# EAGLE design led_analog_clock_v2 (EAGLE 5.09)
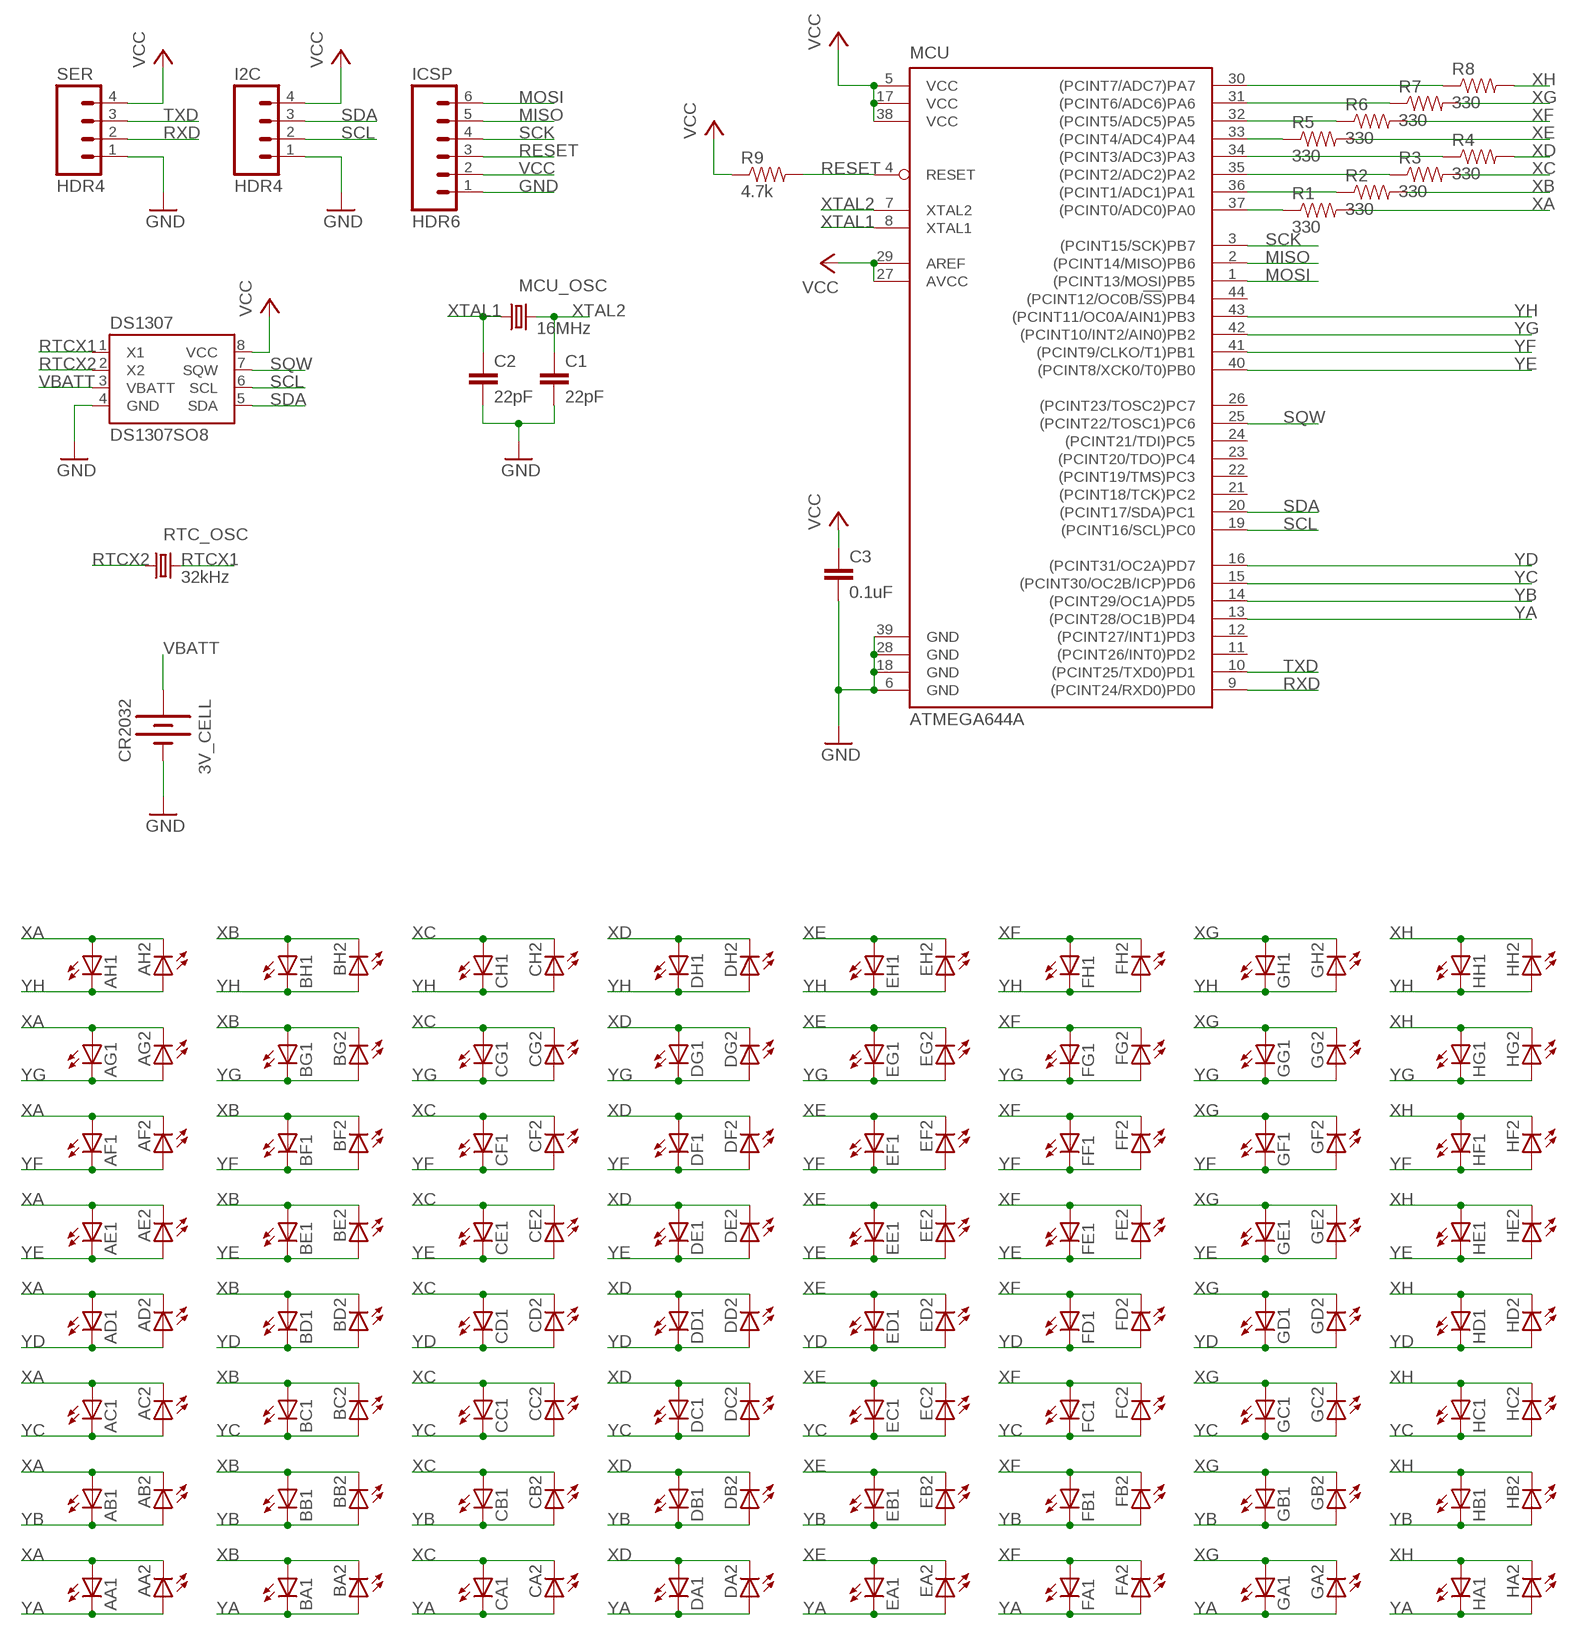
[diagram p0: schematic, sheet 1]

## Parts
3V_CELL  CR2032  BATTERY20PTH  [BATTCOM_20MM_PTH]
AA1  LED0603  [LED-0603]
AA2  LED0603  [LED-0603]
AB1  LED0603  [LED-0603]
AB2  LED0603  [LED-0603]
AC1  LED0603  [LED-0603]
AC2  LED0603  [LED-0603]
AD1  LED0603  [LED-0603]
AD2  LED0603  [LED-0603]
AE1  LED0603  [LED-0603]
AE2  LED0603  [LED-0603]
AF1  LED0603  [LED-0603]
AF2  LED0603  [LED-0603]
AG1  LED0603  [LED-0603]
AG2  LED0603  [LED-0603]
AH1  LED0603  [LED-0603]
AH2  LED0603  [LED-0603]
BA1  LED0603  [LED-0603]
BA2  LED0603  [LED-0603]
BB1  LED0603  [LED-0603]
BB2  LED0603  [LED-0603]
BC1  LED0603  [LED-0603]
BC2  LED0603  [LED-0603]
BD1  LED0603  [LED-0603]
BD2  LED0603  [LED-0603]
BE1  LED0603  [LED-0603]
BE2  LED0603  [LED-0603]
BF1  LED0603  [LED-0603]
BF2  LED0603  [LED-0603]
BG1  LED0603  [LED-0603]
BG2  LED0603  [LED-0603]
BH1  LED0603  [LED-0603]
BH2  LED0603  [LED-0603]
C1  22pF  CAP0603-CAP  [0603-CAP]
C2  22pF  CAP0603-CAP  [0603-CAP]
C3  0.1uF  CAP0603-CAP  [0603-CAP]
CA1  LED0603  [LED-0603]
CA2  LED0603  [LED-0603]
CB1  LED0603  [LED-0603]
CB2  LED0603  [LED-0603]
CC1  LED0603  [LED-0603]
CC2  LED0603  [LED-0603]
CD1  LED0603  [LED-0603]
CD2  LED0603  [LED-0603]
CE1  LED0603  [LED-0603]
CE2  LED0603  [LED-0603]
CF1  LED0603  [LED-0603]
CF2  LED0603  [LED-0603]
CG1  LED0603  [LED-0603]
CG2  LED0603  [LED-0603]
CH1  LED0603  [LED-0603]
CH2  LED0603  [LED-0603]
DA1  LED0603  [LED-0603]
DA2  LED0603  [LED-0603]
DB1  LED0603  [LED-0603]
DB2  LED0603  [LED-0603]
DC1  LED0603  [LED-0603]
DC2  LED0603  [LED-0603]
DD1  LED0603  [LED-0603]
DD2  LED0603  [LED-0603]
DE1  LED0603  [LED-0603]
DE2  LED0603  [LED-0603]
DF1  LED0603  [LED-0603]
DF2  LED0603  [LED-0603]
DG1  LED0603  [LED-0603]
DG2  LED0603  [LED-0603]
DH1  LED0603  [LED-0603]
DH2  LED0603  [LED-0603]
DS1307  DS1307SO8  [SO08]
EA1  LED0603  [LED-0603]
EA2  LED0603  [LED-0603]
EB1  LED0603  [LED-0603]
EB2  LED0603  [LED-0603]
EC1  LED0603  [LED-0603]
EC2  LED0603  [LED-0603]
ED1  LED0603  [LED-0603]
ED2  LED0603  [LED-0603]
EE1  LED0603  [LED-0603]
EE2  LED0603  [LED-0603]
EF1  LED0603  [LED-0603]
EF2  LED0603  [LED-0603]
EG1  LED0603  [LED-0603]
EG2  LED0603  [LED-0603]
EH1  LED0603  [LED-0603]
EH2  LED0603  [LED-0603]
FA1  LED0603  [LED-0603]
FA2  LED0603  [LED-0603]
FB1  LED0603  [LED-0603]
FB2  LED0603  [LED-0603]
FC1  LED0603  [LED-0603]
FC2  LED0603  [LED-0603]
FD1  LED0603  [LED-0603]
FD2  LED0603  [LED-0603]
FE1  LED0603  [LED-0603]
FE2  LED0603  [LED-0603]
FF1  LED0603  [LED-0603]
FF2  LED0603  [LED-0603]
FG1  LED0603  [LED-0603]
FG2  LED0603  [LED-0603]
FH1  LED0603  [LED-0603]
FH2  LED0603  [LED-0603]
GA1  LED0603  [LED-0603]
GA2  LED0603  [LED-0603]
GB1  LED0603  [LED-0603]
GB2  LED0603  [LED-0603]
GC1  LED0603  [LED-0603]
GC2  LED0603  [LED-0603]
GD1  LED0603  [LED-0603]
GD2  LED0603  [LED-0603]
GE1  LED0603  [LED-0603]
GE2  LED0603  [LED-0603]
GF1  LED0603  [LED-0603]
GF2  LED0603  [LED-0603]
GG1  LED0603  [LED-0603]
GG2  LED0603  [LED-0603]
GH1  LED0603  [LED-0603]
GH2  LED0603  [LED-0603]
HA1  LED0603  [LED-0603]
HA2  LED0603  [LED-0603]
HB1  LED0603  [LED-0603]
HB2  LED0603  [LED-0603]
HC1  LED0603  [LED-0603]
HC2  LED0603  [LED-0603]
HD1  LED0603  [LED-0603]
HD2  LED0603  [LED-0603]
HE1  LED0603  [LED-0603]
HE2  LED0603  [LED-0603]
HF1  LED0603  [LED-0603]
HF2  LED0603  [LED-0603]
HG1  LED0603  [LED-0603]
HG2  LED0603  [LED-0603]
HH1  LED0603  [LED-0603]
HH2  LED0603  [LED-0603]
I2C  HDR4  M04PTH  [1X04]
ICSP  HDR6  M06SIP  [1X06]
MCU  ATMEGA644A  [TQFP44]
MCU_OSC  16MHz  CRYSTAL5X3  [CRYSTAL-SMD-5X3]
R1  330  RESISTOR0603-RES  [0603-RES]
R2  330  RESISTOR0603-RES  [0603-RES]
R3  330  RESISTOR0603-RES  [0603-RES]
R4  330  RESISTOR0603-RES  [0603-RES]
R5  330  RESISTOR0603-RES  [0603-RES]
R6  330  RESISTOR0603-RES  [0603-RES]
R7  330  RESISTOR0603-RES  [0603-RES]
R8  330  RESISTOR0603-RES  [0603-RES]
R9  4.7k  RESISTOR0603-RES  [0603-RES]
RTC_OSC  32kHz  CRYSTAL32-SMD  [CRYSTAL-32KHZ-SMD]
SER  HDR4  M04PTH  [1X04]

## Nets
GND [supply]: 3V_CELL.2(-) C1.2 C2.2 C3.2 DS1307.4(GND) I2C.1 ICSP.1 MCU.6(GND) MCU.18(GND) MCU.28(GND) MCU.39(GND) SER.1
MISO: ICSP.5 MCU.2((PCINT14/MISO)PB6)
MOSI: ICSP.6 MCU.1((PCINT13/MOSI)PB5)
N$1: MCU.30((PCINT7/ADC7)PA7) R8.1
N$2: MCU.31((PCINT6/ADC6)PA6) R7.1
N$3: MCU.32((PCINT5/ADC5)PA5) R6.1
N$4: MCU.33((PCINT4/ADC4)PA4) R5.1
N$5: MCU.34((PCINT3/ADC3)PA3) R4.1
N$6: MCU.35((PCINT2/ADC2)PA2) R3.1
N$7: MCU.36((PCINT1/ADC1)PA1) R2.1
N$8: MCU.37((PCINT0/ADC0)PA0) R1.1
RESET: ICSP.3 MCU.4(RESET) R9.2
RTCX1: DS1307.1(X1) RTC_OSC.X2
RTCX2: DS1307.2(X2) RTC_OSC.X1
RXD: MCU.9((PCINT24/RXD0)PD0) SER.2
SCK: ICSP.4 MCU.3((PCINT15/SCK)PB7)
SCL: DS1307.6(SCL) I2C.2 MCU.19((PCINT16/SCL)PC0)
SDA: DS1307.5(SDA) I2C.3 MCU.20((PCINT17/SDA)PC1)
SQW: DS1307.7(SQW) MCU.25((PCINT22/TOSC1)PC6)
TXD: MCU.10((PCINT25/TXD0)PD1) SER.3
VBATT: 3V_CELL.1(+) DS1307.3(VBATT)
VCC [supply]: C3.1 DS1307.8(VCC) I2C.4 ICSP.2 MCU.5(VCC) MCU.17(VCC) MCU.27(AVCC) MCU.29(AREF) MCU.38(VCC) R9.1 SER.4
XA: AA1.A AA2.C AB1.A AB2.C AC1.A AC2.C AD1.A AD2.C AE1.A AE2.C AF1.A AF2.C AG1.A AG2.C AH1.A AH2.C R1.2
XB: BA1.A BA2.C BB1.A BB2.C BC1.A BC2.C BD1.A BD2.C BE1.A BE2.C BF1.A BF2.C BG1.A BG2.C BH1.A BH2.C R2.2
XC: CA1.A CA2.C CB1.A CB2.C CC1.A CC2.C CD1.A CD2.C CE1.A CE2.C CF1.A CF2.C CG1.A CG2.C CH1.A CH2.C R3.2
XD: DA1.A DA2.C DB1.A DB2.C DC1.A DC2.C DD1.A DD2.C DE1.A DE2.C DF1.A DF2.C DG1.A DG2.C DH1.A DH2.C R4.2
XE: EA1.A EA2.C EB1.A EB2.C EC1.A EC2.C ED1.A ED2.C EE1.A EE2.C EF1.A EF2.C EG1.A EG2.C EH1.A EH2.C R5.2
XF: FA1.A FA2.C FB1.A FB2.C FC1.A FC2.C FD1.A FD2.C FE1.A FE2.C FF1.A FF2.C FG1.A FG2.C FH1.A FH2.C R6.2
XG: GA1.A GA2.C GB1.A GB2.C GC1.A GC2.C GD1.A GD2.C GE1.A GE2.C GF1.A GF2.C GG1.A GG2.C GH1.A GH2.C R7.2
XH: HA1.A HA2.C HB1.A HB2.C HC1.A HC2.C HD1.A HD2.C HE1.A HE2.C HF1.A HF2.C HG1.A HG2.C HH1.A HH2.C R8.2
XTAL1: C2.1 MCU.8(XTAL1) MCU_OSC.1
XTAL2: C1.1 MCU.7(XTAL2) MCU_OSC.3
YA: AA1.C AA2.A BA1.C BA2.A CA1.C CA2.A DA1.C DA2.A EA1.C EA2.A FA1.C FA2.A GA1.C GA2.A HA1.C HA2.A MCU.13((PCINT28/OC1B)PD4)
YB: AB1.C AB2.A BB1.C BB2.A CB1.C CB2.A DB1.C DB2.A EB1.C EB2.A FB1.C FB2.A GB1.C GB2.A HB1.C HB2.A MCU.14((PCINT29/OC1A)PD5)
YC: AC1.C AC2.A BC1.C BC2.A CC1.C CC2.A DC1.C DC2.A EC1.C EC2.A FC1.C FC2.A GC1.C GC2.A HC1.C HC2.A MCU.15((PCINT30/OC2B/ICP)PD6)
YD: AD1.C AD2.A BD1.C BD2.A CD1.C CD2.A DD1.C DD2.A ED1.C ED2.A FD1.C FD2.A GD1.C GD2.A HD1.C HD2.A MCU.16((PCINT31/OC2A)PD7)
YE: AE1.C AE2.A BE1.C BE2.A CE1.C CE2.A DE1.C DE2.A EE1.C EE2.A FE1.C FE2.A GE1.C GE2.A HE1.C HE2.A MCU.40((PCINT8/XCK0/T0)PB0)
YF: AF1.C AF2.A BF1.C BF2.A CF1.C CF2.A DF1.C DF2.A EF1.C EF2.A FF1.C FF2.A GF1.C GF2.A HF1.C HF2.A MCU.41((PCINT9/CLKO/T1)PB1)
YG: AG1.C AG2.A BG1.C BG2.A CG1.C CG2.A DG1.C DG2.A EG1.C EG2.A FG1.C FG2.A GG1.C GG2.A HG1.C HG2.A MCU.42((PCINT10/INT2/AIN0)PB2)
YH: AH1.C AH2.A BH1.C BH2.A CH1.C CH2.A DH1.C DH2.A EH1.C EH2.A FH1.C FH2.A GH1.C GH2.A HH1.C HH2.A MCU.43((PCINT11/OC0A/AIN1)PB3)
Unconnected: MCU.11((PCINT26/INT0)PD2) MCU.12((PCINT27/INT1)PD3) MCU.21((PCINT18/TCK)PC2) MCU.22((PCINT19/TMS)PC3) MCU.23((PCINT20/TDO)PC4) MCU.24((PCINT21/TDI)PC5) MCU.26((PCINT23/TOSC2)PC7) MCU.44((PCINT12/OC0B/!SS!)PB4)

## Library data of the parts
3V_CELL = SparkFun:BATTERY: Battery Holders Various common sizes : AA, AAA, 20mm coin cell and 12mm coin cell.
AA1 AA2 AB1 AB2 AC1 AC2 AD1 AD2 AE1 AE2 AF1 AF2 AG1 AG2 AH1 AH2 BA1 BA2 BB1 BB2 BC1 BC2 BD1 BD2 BE1 BE2 BF1 BF2 BG1 BG2 BH1 BH2 CA1 CA2 CB1 CB2 CC1 CC2 CD1 CD2 CE1 CE2 CF1 CF2 CG1 CG2 CH1 CH2 DA1 DA2 DB1 DB2 DC1 DC2 DD1 DD2 DE1 DE2 DF1 DF2 DG1 DG2 DH1 DH2 EA1 EA2 EB1 EB2 EC1 EC2 ED1 ED2 EE1 EE2 EF1 EF2 EG1 EG2 EH1 EH2 FA1 FA2 FB1 FB2 FC1 FC2 FD1 FD2 FE1 FE2 FF1 FF2 FG1 FG2 FH1 FH2 GA1 GA2 GB1 GB2 GC1 GC2 GD1 GD2 GE1 GE2 GF1 GF2 GG1 GG2 GH1 GH2 HA1 HA2 HB1 HB2 HC1 HC2 HD1 HD2 HE1 HE2 HF1 HF2 HG1 HG2 HH1 HH2 = SparkFun:LED: LEDs Standard schematic elements and footprints for 5mm, 3mm, 1206, and 0603 sized LEDs. 5mm - Spark Fun Electronics SKU : COM-00529 (and others)
C1-C3 = SparkFun:CAP: Capacitor Standard 0603 ceramic capacitor, and 0.1" leaded capacitor.
DS1307 = SparkFun:DS1307
I2C SER = SparkFun:M04: Header 4 Standard 4-pin 0.1" header. Use with straight break away headers (SKU : PRT-00116), right angle break away headers (PRT-00553), swiss pins (PRT-00743), machine pins (PRT-00117), and female headers (PRT-00115). Molex polarized connector foot print use with SKU : PRT-08231 with associated crimp pins and housings.
ICSP = SparkFun:M06: Header 6 Standard 6-pin 0.1" header. Use with straight break away headers (SKU : PRT-00116), right angle break away headers (PRT-00553), swiss pins (PRT-00743), machine pins (PRT-00117), and female headers (PRT-00115). Molex polarized connector foot print use with SKU : PRT-08094 with associated crimp pins and housings. NOTES ON THE VARIANTS LOCK and LOCK_LONGPADS... This footprint was designed to help hold the alignment of a through-hole component (i.e. 6-pin header) while soldering it into place. You may notice that each hole has been shifted either up or down by 0.005 of an inch from it's more standard position (which is a perfectly straight line). This slight alteration caused the pins (the squares in the middle) to touch the edges of the holes. Because they are alternating, it causes a "brace" to hold the component in place. 0.005 has proven to be the perfect amount of "off-center" position when using our standard breakaway headers. Although looks a little odd when you look at the bare footprint, once you have a header in there, the alteration is very hard to notice. Also, if you push a header all the way into place, it is covered up entirely on the bottom side. This idea of altering the position of holes to aid alignment will be further integrated into the Sparkfun Library for other footprints. It can help hold any component with 3 or more connection pins.
MCU = atmel:ATMEGA644: 8-bit Microcontroller with 64K Bytes In-System Programmable Flash Source: http://www.atmel.com/dyn/resources/prod_documents/doc2593.pdf
MCU_OSC RTC_OSC = SparkFun:CRYSTAL: Crystals Various standard crystals. Proven footprints. Spark Fun Electronics SKU : COM-00534
R1-R9 = SparkFun:RESISTOR: Resistor Basic schematic elements and footprints for 0603, 1206, and PTH 1/10th watt (small) resistors.

## Net classes
0 signal: width 0.203 mm
1 supply: width 0.305 mm

## Board
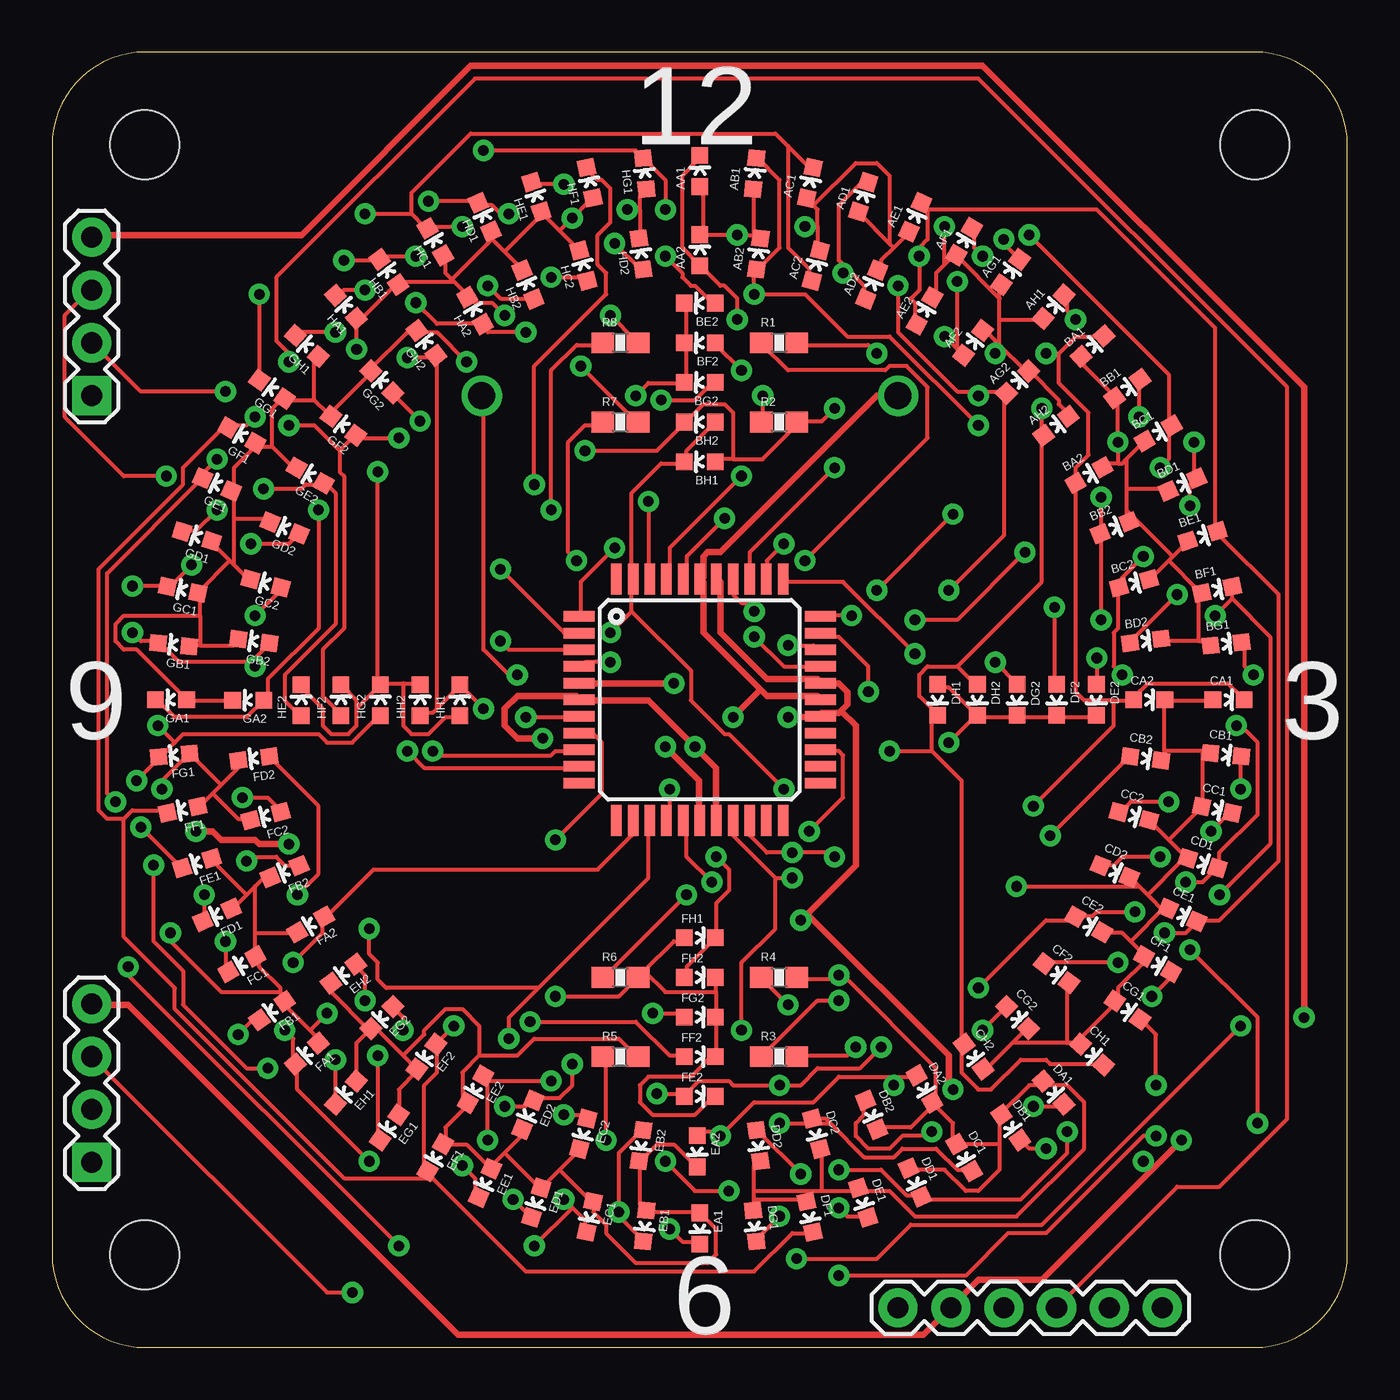
[diagram p1: board, top side]
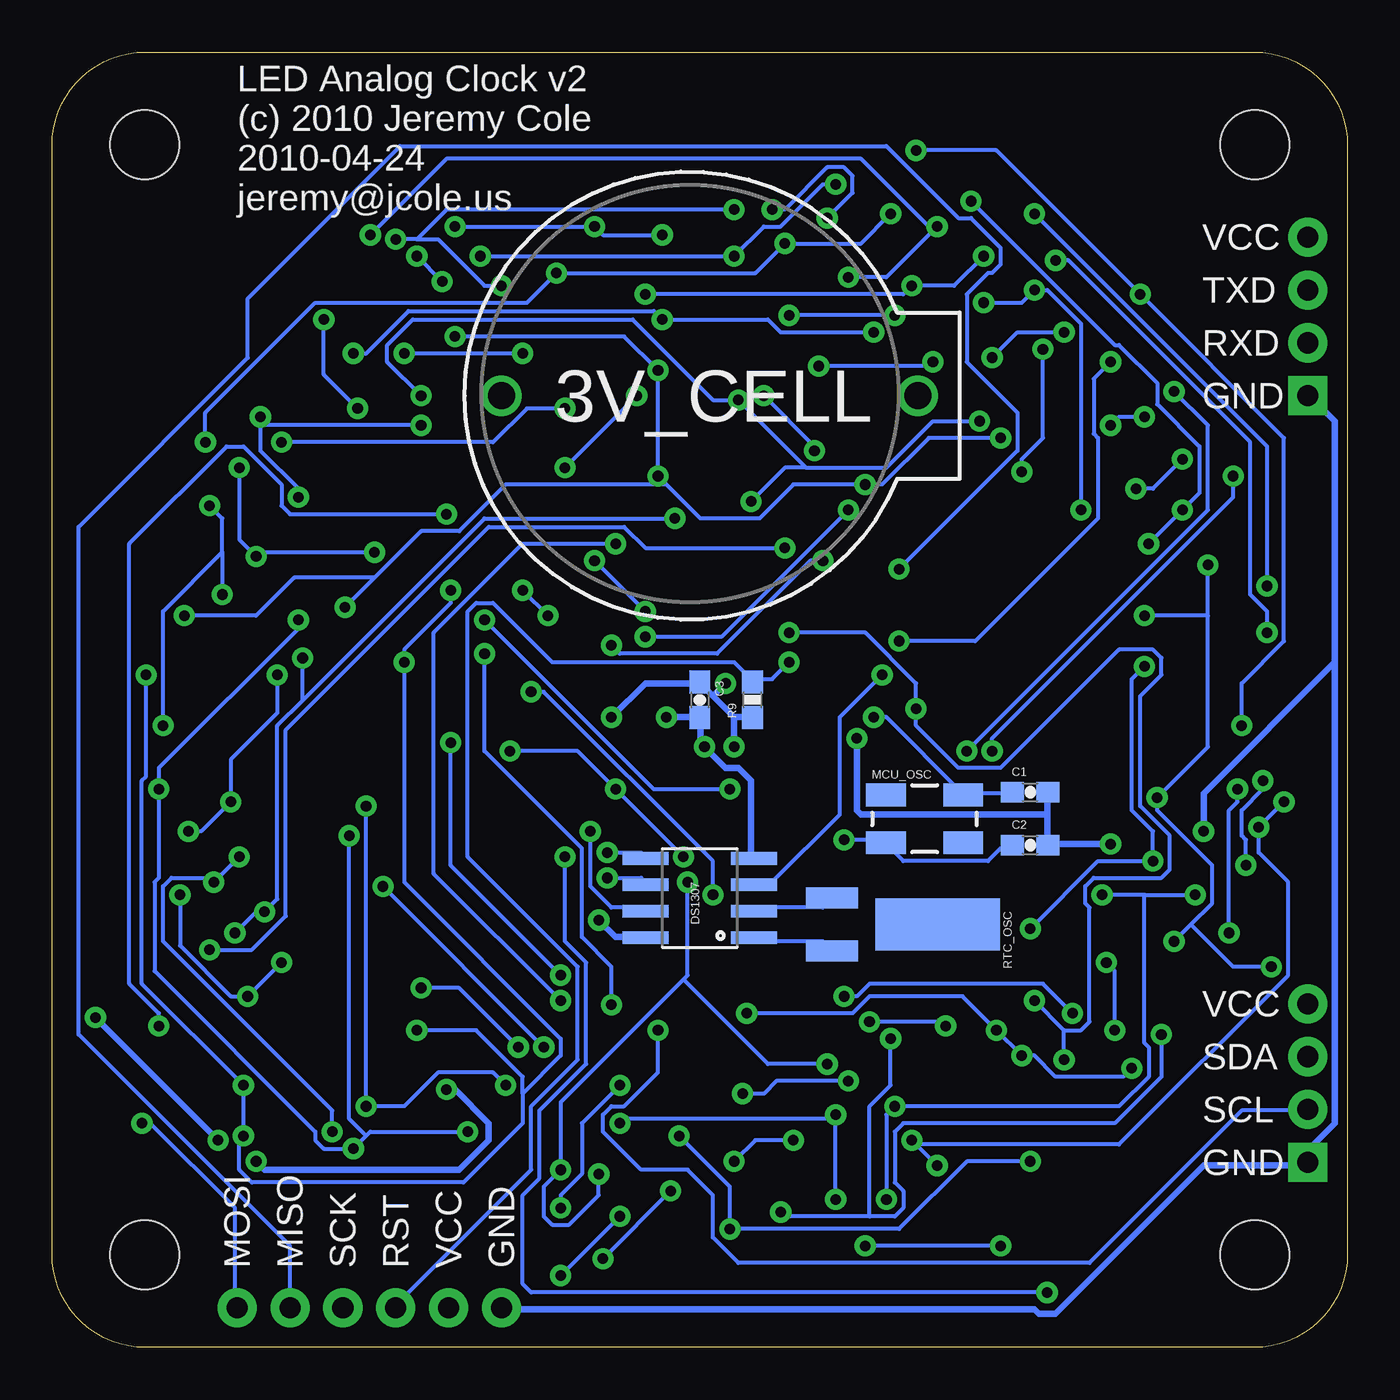
[diagram p2: board, bottom side, seen from below]

Size 62.23 x 62.23 mm. Coordinates in mm from the lower left corner, seen from the top.
Outline: 0,4.49 arc90 4.49,0 57.74,0 arc90 62.23,4.49 62.23,57.74 arc90 57.74,62.23 4.49,62.23 arc90 0,57.74 0,4.49
Copper layers (1*16): Top 0.035mm / dielectric 1.5mm / Bottom 0.035mm
Design rules "SparkFun": minimum track width 8mil, minimum drill 20mil, track to track 8mil, track to pad 8mil, pad to pad 8mil, via to via 8mil, smd to smd 8mil, copper to edge 10mil, drill to drill 8mil, minimum pad ring 12mil, minimum via ring 10mil, stop-mask expansion 4mil, vias tented up to drill 25mil, thermal gap 10mil
tRestrict: area 17.1,23.5 to 23.5,27.3; area 15.9,17.8 to 23.5,22.9; area 0,0 to 7.6,7.6; area 54.6,0 to 62.2,7.6; area 0,54.6 to 7.6,62.2; area 54.6,54.6 to 62.2,62.2
bRestrict: area 15.9,17.8 to 23.5,22.9; area 0,54.6 to 7.6,62.2; area 54.6,54.6 to 62.2,62.2; area 54.6,0 to 62.2,7.6; area 0,0 to 7.6,7.6
vRestrict: area 0,28.6 to 3.8,33.7; area 58.4,28.6 to 62.2,33.7; area 29.2,0 to 33,5.1; area 27.3,57.1 to 34.9,62.2; area 0.6,7.6 to 7.6,17.8; area 0.6,44.5 to 7.6,54.6; area 39.4,0.6 to 54.6,8.3; area 15.9,17.8 to 27.3,22.9; area 17.1,23.5 to 23.5,27.3; area 31.1,54.6 to 54,62.2

### Footprints (pad centres in the part's own frame; a part is rotated, then mirrored left to right if it is on the bottom)
BATTCOM_20MM_PTH = drill 1.3 round: 1 20,0; 2 0,0
LED-0603 = smd 0.8 x 0.8: A 0,-0.75; C 0,0.75
0603-CAP = smd 1.1 x 1: 1 -0.85,0; 2 0.85,0
SO08 = smd 0.61 x 2.21: 1 -1.905,-2.616; 2 -0.635,-2.616; 3 0.635,-2.616; 4 1.905,-2.616; 5 1.905,2.616; 6 0.635,2.616; 7 -0.635,2.616; 8 -1.905,2.616
1X04 = drill 1.016 pad 1.88 square: 1 0,0 | drill 1.016 pad 1.88 round: 2 2.54,0; 3 5.08,0; 4 7.62,0
1X06 = drill 1.016 pad 1.88 round: 1 0,0; 2 2.54,0; 3 5.08,0; 4 7.62,0; 5 10.16,0; 6 12.7,0
TQFP44 = smd 1.5 x 0.5: 1 -5.8,4; 2 -5.8,3.2; 3 -5.8,2.4; 4 -5.8,1.6; 5 -5.8,0.8; 6 -5.8,0; 7 -5.8,-0.8; 8 -5.8,-1.6; 9 -5.8,-2.4; 10 -5.8,-3.2; 11 -5.8,-4; 23 5.8,-4; 24 5.8,-3.2; 25 5.8,-2.4; 26 5.8,-1.6; 27 5.8,-0.8; 28 5.8,0; 29 5.8,0.8; 30 5.8,1.6; 31 5.8,2.4; 32 5.8,3.2; 33 5.8,4 | smd 0.5 x 1.5: 12 -4,-5.8; 13 -3.2,-5.8; 14 -2.4,-5.8; 15 -1.6,-5.8; 16 -0.8,-5.8; 17 0,-5.8; 18 0.8,-5.8; 19 1.6,-5.8; 20 2.4,-5.8; 21 3.2,-5.8; 22 4,-5.8; 34 4,5.8; 35 3.2,5.8; 36 2.4,5.8; 37 1.6,5.8; 38 0.8,5.8; 39 0,5.8; 40 -0.8,5.8; 41 -1.6,5.8; 42 -2.4,5.8; 43 -3.2,5.8; 44 -4,5.8
CRYSTAL-SMD-5X3 = smd 1.9 x 1.1: 1 -1.85,-1.15; 2 1.85,-1.15; 3 1.85,1.15; 4 -1.85,1.15
0603-RES = smd 1.1 x 1: 1 -0.85,0; 2 0.85,0
CRYSTAL-32KHZ-SMD = smd 2.5 x 6: SHEILD 0,5.08 | smd 1 x 2.5: X1 -1.27,0; X2 1.27,0
STAND-OFF = hole 3.302: 0,0

### Placement (x,y rotation side)
3V_CELL  40.64,45.72 0 bottom
AA1  31.11,56.52 0 top
AA2  31.11,52.7 0 top
AB1  33.76,56.39 354 top
AB2  33.93,52.53 352.5 top
AC1  36.41,55.95 348 top
AC2  36.7,51.97 345 top
AD1  38.97,55.27 342 top
AD2  39.38,51.05 337.5 top
AE1  41.47,54.3 336 top
AE2  41.92,49.8 330 top
AF1  43.81,53.12 330 top
AF2  44.24,48.26 322.5 top
AG1  46.04,51.66 324 top
AG2  46.38,46.37 315 top
AH1  48.12,49.99 318 top
AH2  48.23,44.27 307.5 top
BA1  49.99,48.1 312 top
BA2  49.82,41.9 300 top
BB1  51.66,46.06 306 top
BB2  51.04,39.38 292.5 top
BC1  53.14,43.91 300 top
BC2  51.98,36.71 285 top
BD1  54.3,41.45 294 top
BD2  52.53,33.94 277.5 top
BE1  55.27,38.98 288 top
BE2  31.11,50.16 90 top
BF1  55.96,36.4 282 top
BF2  31.11,48.26 90 top
BG1  56.4,33.8 276 top
BG2  31.11,46.35 90 top
BH1  31.11,42.55 90 top
BH2  31.11,44.45 90 top
C1  15.24,26.67 0 bottom
C2  15.24,24.13 0 bottom
C3  31.11,31.11 270 bottom
CA1  56.52,31.11 270 top
CA2  52.7,31.11 270 top
CB1  56.39,28.47 264 top
CB2  52.53,28.3 262.5 top
CC1  55.96,25.83 258 top
CC2  51.97,25.53 255 top
CD1  55.27,23.27 252 top
CD2  51.05,22.86 247.5 top
CE1  54.31,20.78 246 top
CE2  49.81,20.32 240 top
CF1  53.11,18.41 240 top
CF2  48.26,17.98 232.5 top
CG1  51.66,16.21 234 top
CG2  46.38,15.85 225 top
CH1  49.96,14.07 228 top
CH2  44.27,13.97 217.5 top
DA1  48.11,12.24 222 top
DA2  41.91,12.42 210 top
DB1  46.05,10.57 216 top
DB2  39.37,11.18 202.5 top
DC1  43.81,9.12 210 top
DC2  36.7,10.26 195 top
DD1  41.45,7.92 204 top
DD2  33.93,9.7 187.5 top
DE1  38.96,6.96 198 top
DE2  50.16,31.11 180 top
DF1  36.4,6.27 192 top
DF2  48.26,31.11 180 top
DG1  33.76,5.84 186 top
DG2  46.35,31.11 180 top
DH1  42.55,31.11 180 top
DH2  44.45,31.11 180 top
DS1307  31.11,21.59 90 bottom
EA1  31.11,5.71 180 top
EA2  30.99,9.42 180 top
EB1  28.47,5.84 174 top
EB2  28.3,9.7 172.5 top
EC1  25.83,6.27 168 top
EC2  25.53,10.26 165 top
ED1  23.27,6.96 162 top
ED2  22.86,11.18 157.5 top
EE1  20.8,7.9 156 top
EE2  20.35,12.4 150 top
EF1  18.41,9.12 150 top
EF2  17.98,13.97 142.5 top
EG1  16.21,10.57 144 top
EG2  15.85,15.85 135 top
EH1  14.12,12.24 138 top
EH2  14,17.96 127.5 top
FA1  12.24,14.12 132 top
FA2  12.42,20.32 120 top
FB1  10.57,16.18 126 top
FB2  11.18,22.86 112.5 top
FC1  9.12,18.41 120 top
FC2  10.26,25.53 105 top
FD1  7.92,20.78 114 top
FD2  9.7,28.3 97.5 top
FE1  6.96,23.27 108 top
FE2  31.11,12.06 270 top
FF1  6.27,25.83 102 top
FF2  31.11,13.97 270 top
FG1  5.87,28.45 96 top
FG2  31.11,15.88 270 top
FH1  31.11,19.68 270 top
FH2  31.11,17.78 270 top
GA1  5.71,31.11 90 top
GA2  9.42,31.09 90 top
GB1  5.84,33.76 84 top
GB2  9.7,33.93 82.5 top
GC1  6.27,36.4 78 top
GC2  10.26,36.7 75 top
GD1  6.96,38.96 72 top
GD2  11.18,39.37 67.5 top
GE1  7.92,41.45 66 top
GE2  12.4,41.88 60 top
GF1  9.12,43.81 60 top
GF2  14,44.27 52.5 top
GG1  10.57,46.02 54 top
GG2  15.85,46.38 45 top
GH1  12.24,48.11 48 top
GH2  17.98,48.26 37.5 top
HA1  14.12,49.99 42 top
HA2  20.32,49.81 30 top
HB1  16.18,51.66 36 top
HB2  22.86,51.05 22.5 top
HC1  18.41,53.11 30 top
HC2  25.53,51.97 15 top
HD1  20.78,54.31 24 top
HD2  28.3,52.53 7.5 top
HE1  23.27,55.27 18 top
HE2  11.96,31.09 0 top
HF1  25.83,55.96 12 top
HF2  13.87,31.09 0 top
HG1  28.47,56.39 6 top
HG2  15.77,31.09 0 top
HH1  19.58,31.09 0 top
HH2  17.68,31.09 0 top
I2C  1.91,8.89 90 top
ICSP  40.64,1.91 0 top
MCU  31.11,31.11 0 top
MCU_OSC  20.32,25.4 0 bottom
R1  34.92,48.26 0 top
R2  34.92,44.45 0 top
R3  34.92,13.97 0 top
R4  34.92,17.78 0 top
R5  27.3,13.97 0 top
R6  27.3,17.78 0 top
R7  27.3,44.45 0 top
R8  27.3,48.26 0 top
R9  28.57,31.11 90 bottom
RTC_OSC  24.77,20.32 270 bottom
SER  1.91,45.72 90 top
U$1  [STAND-OFF]  57.78,57.78 0 top
U$2  [STAND-OFF]  4.45,57.78 0 top
U$3  [STAND-OFF]  4.45,4.45 0 top
U$4  [STAND-OFF]  57.78,4.45 0 top

### Tracks (layer width: path | path; a pad name or v marks a point on that pad's centre or on a via)
GND  (via drill 0.51)
  Top 0.305: MCU.18 31.9,25.4 31.9,27.84 v30.89,28.85 28.65,31.09 25.4,31.09 MCU.6 25.2,31.29 22.35,31.29 21.74,30.68 21.74,29.87 22.35,29.26 v23.57,29.26 | 34.04,31.6 34.34,31.29 36.78,31.29 MCU.28 | 34.04,31.6 31.29,34.34 31.29,36.78 MCU.39 31.29,36.98 31.29,38 31.5,38.2 32.11,38.2 39.62,45.72 3V_CELL.2 | v32.72,30.28 34.04,31.6 | v11.38,24.18 9.96,24.18 9.75,24.38 8.13,24.38 7.72,24.79 v6.91,24.79
  Bottom 0.305: DS1307.4 28.65,23.57 28.65,27.23 29.26,27.84 29.87,27.84 v30.89,28.85 31.09,29.06 31.09,30.07 C3.2 31.29,30.28 v32.72,30.28 | 14.43,25.6 14.43,26.62 C1.2 | 14.43,25.6 14.43,24.18 C2.2 14.22,24.18 v11.38,24.18 | 14.43,25.6 23.37,25.6 23.57,25.81 v23.57,29.26 | 0.61,32.92 0.61,44.5 1.83,45.72 SER.1 | 0.61,32.92 0.61,10.77 1.83,9.55 1.83,8.94 I2C.1 2.03,8.74 6.91,8.74 14.02,1.63 14.83,1.63 15.04,1.83 40.64,1.83 ICSP.1 | v6.91,24.79 6.91,26.62 0.61,32.92
MISO  (via drill 0.51)
  Top 0.203: v21.54,37.39 24.59,34.34 25.2,34.34 MCU.2
  Bottom 0.203: v21.54,37.39 15.85,43.08 15.85,44.91 18.29,47.35 18.29,50.6 17.27,51.61 17.07,51.61 16.66,52.02 16.66,52.83 18.09,54.25 18.69,54.25 22.15,57.71 45.52,57.71 52.83,50.39 52.83,47.55 60.96,39.42 60.96,15.04 50.8,4.88 ICSP.5
MOSI  (via drill 0.51)
  Top 0.203: v27.03,38.41 25.4,36.78 25.4,35.15 MCU.1 | v54.66,19.1 57.91,15.85 v57.91,10.77
  Bottom 0.203: v27.03,38.41 33.73,38.41 34.75,39.42 41.25,39.42 51,29.67 51,20.73 52.63,19.1 v54.66,19.1 | v57.91,10.77 57.51,10.77 53.44,6.71 53.44,2.03 ICSP.6
N$1  (via drill 0.51)
  Top 0.203: v23.98,40.23 23.98,46.94 25.2,48.16 26.42,48.16 R8.1 | v33.73,34.14 35.15,32.72 36.78,32.72 MCU.30
  Bottom 0.203: v23.98,40.23 30.07,34.14 v33.73,34.14
N$2  (via drill 0.51)
  Top 0.203: v25.2,37.8 24.79,38.2 24.79,43.48 25.6,44.3 26.42,44.3 R7.1 | v35.36,33.73 36.58,33.73 36.78,33.53 MCU.31
  Bottom 0.203: v25.2,37.8 25.81,37.8 30.28,33.33 34.95,33.33 v35.36,33.73
N$3  (via drill 0.51)
  Top 0.203: v30.48,21.74 26.62,17.88 R6.1 | v39.22,31.5 39.22,32.72 37.8,34.14 36.98,34.14 MCU.32
  Bottom 0.203: v30.48,21.74 30.48,23.37 38.61,31.5 v39.22,31.5
N$4  (via drill 0.51)
  Top 0.203: v26.62,9.96 26.62,13.82 R5.1 | v29.46,8.94 30.89,7.52 v32.51,7.52 | v35.76,4.27 39.62,4.27 41.25,5.89 47.55,5.89 v57.1,15.44 | v43.28,40.03 v39.62,36.37 | v38.41,35.15 36.98,35.15 MCU.33
  Bottom 0.203: v26.62,9.96 28.45,9.96 v29.46,8.94 | v32.51,7.52 v35.76,4.27 | v57.1,15.44 57.1,16.05 58.52,17.48 58.52,38.61 53.85,43.28 53.03,43.28 51.21,41.45 51.21,40.44 50.8,40.03 v43.28,40.03 | v39.62,36.37 v38.41,35.15
N$5  (via drill 0.51)
  Top 0.203: v35.36,16.46 34.14,17.68 R4.1 | v41.45,33.33 38,36.78 35.15,36.78 MCU.34
  Bottom 0.203: v35.36,16.46 35.36,18.29 36.78,19.71 36.78,23.98 41.45,28.65 v41.45,33.33
N$6  (via drill 0.51)
  Top 0.203: v37.8,16.66 36.78,16.66 34.14,14.02 R3.1 | v35.15,38.61 34.34,37.8 34.34,36.98 MCU.35
  Bottom 0.203: v37.8,16.66 43.89,22.76 43.89,34.34 39.62,38.61 v35.15,38.61
N$7  (via drill 0.51)
  Top 0.203: v34.14,45.72 34.14,44.5 R2.1 | v37.59,42.27 33.53,38.2 33.53,36.98 MCU.36
  Bottom 0.203: v37.59,42.27 v34.14,45.72
N$8  (via drill 0.51)
  Top 0.203: v36.17,37.8 42.06,43.69 42.06,46.13 41.05,47.14 40.23,47.14 40.03,46.94 35.36,46.94 34.14,48.16 R1.1 | v33.73,35.36 33.33,35.76 33.12,35.76 32.72,36.17 32.72,36.78 MCU.37
  Bottom 0.203: v33.73,35.36 v36.17,37.8
RESET  (via drill 0.51)
  Top 0.203: v26.82,32.92 25.6,32.92 25.4,32.72 MCU.4
  Bottom 0.203: v26.82,32.92 27.64,32.11 28.45,32.11 R9.2 28.65,32.11 29.46,32.92 38.2,32.92 41.05,35.76 41.86,35.76 42.27,35.36 42.27,23.57 36.98,18.29 36.98,13.82 39.22,11.58 39.22,8.53 45.72,2.03 ICSP.3
RTCX1
  Bottom 0.203: DS1307.1 28.45,19.51 25.2,19.51 24.79,19.1 RTC_OSC.X2
RTCX2
  Bottom 0.203: DS1307.2 28.45,21.13 25.2,21.13 24.79,21.54 RTC_OSC.X1
RXD  (via drill 0.51)
  Top 0.203: v18.29,28.65 18.49,28.45 23.98,28.45 24.18,28.65 25.2,28.65 MCU.9 | v8.33,45.92 4.27,45.92 2.03,48.16 SER.2
  Bottom 0.203: v18.29,28.65 6.71,40.23 6.71,44.3 v8.33,45.92
SCK  (via drill 0.51)
  Top 0.203: v21.54,33.93 21.95,33.53 25.2,33.53 MCU.3 | v11.38,47.35 11.38,47.75 10.77,48.36 10.77,51.41 20.32,60.96 44.5,60.96 59.33,46.13 59.33,10.97 56.08,7.72 54.05,7.72 48.36,2.03 ICSP.4
  Bottom 0.203: v21.54,33.93 17.88,33.93 11.99,39.83 11.99,43.69 12.19,43.89 12.19,46.53 v11.38,47.35
SCL  (via drill 0.51)
  Top 0.203: 34.75,22.55 32.72,24.59 32.72,25.2 MCU.19 | 34.75,22.55 v35.56,22.55 | 34.75,22.55 34.75,20.12 33.12,18.49 v33.12,15.24
  Bottom 0.203: v35.56,22.55 33.93,22.55 33.73,22.35 DS1307.6 | v33.12,15.24 33.12,13.21 34.75,11.58 35.36,11.58 35.76,11.18 35.76,10.36 33.93,8.53 31.7,8.53 30.48,7.32 30.48,5.28 29.26,4.06 12.39,4.06 5.08,11.38 2.03,11.38 I2C.2
SDA  (via drill 0.51)
  Top 0.203: MCU.20 33.53,25.2 33.53,24.59 34.34,23.77 v35.56,23.77 37.39,23.77 v37.59,23.57 | v14.43,2.64 13.21,2.64 2.03,13.82 I2C.3
  Bottom 0.203: v35.56,23.77 33.93,23.77 33.73,23.57 DS1307.5 | v37.59,23.57 37.59,19.51 36.58,18.49 36.58,13.61 38.81,11.38 38.81,8.13 39.62,7.32 39.62,3.05 39.22,2.64 v14.43,2.64
SQW  (via drill 0.51)
  Top 0.203: v36.37,24.79 38,26.42 38,28.45 37.8,28.65 36.98,28.65 MCU.25
  Bottom 0.203: v36.37,24.79 36.37,22.15 35.36,21.13 33.73,21.13 DS1307.7
TXD  (via drill 0.51)
  Top 0.203: v17.07,28.65 17.88,27.84 25.2,27.84 MCU.10 | v5.49,41.86 3.45,41.86 0.61,44.7 0.61,49.58 1.83,50.8 SER.3
  Bottom 0.203: v17.07,28.65 17.07,29.26 5.49,40.84 v5.49,41.86
VBATT  (via drill 0.51)
  Top 0.203: v22.35,32.31 21.95,32.31 20.73,33.53 20.73,45.72 3V_CELL.1
  Bottom 0.203: v22.35,32.31 24.38,30.28 24.38,25.6 27.64,22.35 28.45,22.35 DS1307.3
VCC  (via drill 0.51)
  Top 0.305: v29.46,28.85 31.09,27.23 31.09,25.4 MCU.17 | v29.87,31.9 25.4,31.9 MCU.5 | 37.9,30.58 38.2,30.89 38.2,31.5 37.8,31.9 36.98,31.9 MCU.29 36.78,32.11 34.34,32.11 32.11,34.34 32.11,36.78 MCU.38 | 37.9,30.58 37.8,30.48 36.98,30.48 MCU.27 36.78,30.28 v35.36,30.28 | 37.9,30.58 38.61,29.87 38.61,23.16 v35.97,20.52 36.37,20.73 43.08,14.02 43.08,12.6 v43.28,12.39 | I2C.4 2.03,16.46 3.66,16.46 19.51,0.61 41.86,0.61 43.08,1.83 ICSP.2 43.28,2.03 44.5,3.25 47.55,3.25 52.83,8.53 | v60.15,15.85 60.15,46.13 44.7,61.57 20.12,61.57 11.99,53.44 2.03,53.44 SER.4 | 52.83,8.53 v54.25,9.96 | 52.83,8.53 v52.43,8.94
  Bottom 0.305: 29.46,30.28 28.65,30.28 R9.1 | 30.48,31.29 31.09,31.9 C3.1 31.29,31.9 33.73,31.9 v35.36,30.28 | 30.48,31.29 29.46,30.28 | 29.46,30.28 v29.46,28.85 | 30.48,31.29 v29.87,31.9 | v35.97,20.52 35.15,19.71 33.73,19.71 DS1307.8 | v54.25,9.96 v60.15,15.85 | v43.28,12.39 42.88,12.39 41.25,10.77 41.25,9.96 42.67,8.53 52.02,8.53 v52.43,8.94
XA  (via drill 0.51)
  Top 0.203: AA1.A 31.29,55.68 31.29,53.65 AA2.C 31.29,53.44 v32.92,53.44 33.73,53.44 | 33.73,53.44 33.93,53.44 AB2.C 33.73,53.44 | 33.73,53.44 33.73,55.47 AB1.A | 36.78,53.85 36.78,54.66 36.58,54.86 | 36.78,53.85 36.78,52.83 AC2.C | 36.58,54.86 36.37,55.07 AC1.A 36.58,54.86 | 40.44,52.83 41.05,53.44 AE1.A | 40.44,52.83 39.83,52.22 39.83,51.82 AD2.C | 40.23,53.03 40.44,52.83 | 40.23,53.03 38.81,54.46 AD1.A | 36.58,54.86 38.61,56.9 39.62,56.9 40.23,56.29 40.23,53.03 | v36.17,53.85 36.78,53.85 | 42.88,52.02 43.28,52.43 AF1.A 43.48,52.43 45.52,50.39 | 42.88,52.02 42.47,51.61 42.47,50.6 AE2.C | 45.31,48.36 44.7,48.97 AF2.C | 45.31,48.36 45.52,48.16 | 45.52,48.16 46.74,46.94 AG2.C 46.94,46.94 48.36,45.52 48.36,45.31 48.77,44.91 AH2.C | 45.52,48.16 45.52,49.38 | 45.52,49.38 45.52,50.39 | 45.52,50.39 45.52,51 AG1.A | 45.52,49.38 47.55,49.38 AH1.A | v39.62,47.75 39.22,48.16 35.97,48.16 R1.2 | v45.31,47.75 45.31,48.36 | 42.88,52.02 v42.88,53.85
  Bottom 0.203: v32.92,53.44 35.76,53.44 v36.17,53.85 v42.88,53.85 | v39.62,47.75 v45.31,47.75
XB  (via drill 0.51)
  Top 0.203: BE2.C 30.48,49.99 30.48,48.36 BF2.C 30.48,48.16 30.48,46.53 BG2.C 30.28,46.33 28.65,46.33 v28.04,45.72 | 32.72,42.67 34.14,42.67 35.76,44.3 R2.2 35.97,44.5 36.98,44.5 v37.59,45.11 | 32.72,42.67 31.9,42.67 BH1.A | 32.72,42.67 32.72,44.91 32.31,45.31 31.29,45.31 30.48,44.5 BH2.C 30.28,44.3 29.06,43.08 v25.6,43.08 | 55.07,33.93 55.27,33.93 55.47,33.73 BG1.A | 55.07,33.93 53.44,33.93 BD2.C | 53.85,38 54.46,38.61 BE1.A | 53.85,38 53.65,37.8 | 53.65,37.8 52.83,36.98 BC2.C | 53.65,37.8 55.07,36.37 BF1.A 55.07,36.17 55.07,33.93 | 51.21,42.47 51.41,42.47 51.61,42.67 | 51.21,42.47 50.6,42.47 BA2.C | 51.61,42.67 52.43,43.48 BC1.A | 51.21,42.47 v51.21,43.48 51.21,45.52 BB1.A 51,45.72 49.58,47.14 49.58,47.55 BA1.A | 51.61,42.67 51.61,41.25 | 51.61,41.25 51.61,40.23 | 51.61,40.23 51.61,39.83 BB2.C | 51.61,41.25 53.44,41.25 BD1.A | 51.61,40.23 53.85,38
  Bottom 0.203: v28.04,45.72 25.6,43.28 v25.6,43.08 | v37.59,45.11 39.42,45.11 41.05,43.48 v51.21,43.48
XC  (via drill 0.51)
  Top 0.203: 53.65,24.38 54.46,23.57 CD1.A 54.46,23.37 54.25,23.37 52.63,21.74 | 53.65,24.38 52.83,25.2 CC2.C | 53.65,24.38 55.07,25.81 CC1.A 55.27,26.01 55.27,28.65 | 53.44,28.65 53.44,31.09 CA2.C 53.65,31.09 55.68,31.09 CA1.A | 53.44,28.65 53.44,28.25 CB2.C | 55.27,28.65 53.44,28.65 | 55.27,28.65 55.47,28.65 CB1.A 55.27,28.65 | 46.13,14.63 46.74,15.24 CG2.C | 46.13,14.63 44.91,13.41 CH2.C | 48.77,14.63 46.13,14.63 | 49.17,14.63 48.77,14.63 | 49.17,14.63 49.38,14.63 CH1.A 49.17,14.63 | 49.17,14.63 51,16.46 CG1.A 51.21,16.66 51.21,17.27 52.63,18.69 CF1.A 52.43,18.9 51.82,19.51 | 48.77,14.63 48.77,17.48 CF2.C | 51.82,19.51 51.41,19.91 50.6,19.91 CE2.C | 52.63,21.74 53.44,20.93 CE1.A 53.44,21.13 51.82,19.51 | 52.22,22.15 52.63,21.74 | 52.22,22.15 51.82,22.55 CD2.C | v38.61,14.43 38.2,14.02 35.97,14.02 R3.2 | v46.33,22.15 52.22,22.15
  Bottom 0.203: v38.61,14.43 v46.33,22.15
XD  (via drill 0.51)
  Top 0.203: 33.73,7.52 33.73,8.74 33.93,8.94 DD2.C | 33.73,7.11 33.73,7.52 | 33.73,7.11 33.73,6.71 DG1.A | 33.73,7.11 36.17,7.11 DF1.A | 33.73,7.52 36.98,7.52 | 36.98,7.52 38.61,7.52 DE1.A 38.81,7.52 40.23,7.52 41.45,6.3 46.33,6.3 49.58,9.55 49.58,11.79 48.77,12.6 47.75,12.6 DA1.A 47.55,12.6 46.94,12.6 45.52,11.18 DB1.A 45.52,10.97 45.52,9.75 | 36.98,7.52 36.98,9.35 DC2.C | 45.52,9.75 45.52,8.53 44.5,7.52 43.89,7.52 42.88,8.53 41.25,8.53 DD1.A | 45.52,9.75 43.48,9.75 DC1.A 43.28,9.96 43.28,10.77 42.47,11.58 DA2.C | DE2.C 49.99,30.28 48.36,30.28 DF2.C 48.16,30.28 46.53,30.28 DG2.C 46.33,30.28 44.5,30.28 DH2.C | DH1.A 42.67,31.7 43.08,31.7 44.3,30.48 DH2.C | DB2.C 39.83,10.57 41.25,10.57 42.27,11.58 DA2.C | 37.8,17.68 38.2,17.68 42.47,13.41 42.47,11.79 DA2.C | 37.8,17.68 35.97,17.68 R4.2 | v43.08,29.06 44.3,30.28 DH2.C | 37.8,17.68 v37.8,17.88
  Bottom 0.203: v43.08,29.06 43.08,23.16 v37.8,17.88
XE
  Top 0.203: 28.25,8.94 28.25,6.91 28.45,6.71 EB1.A 28.65,6.5 31.09,6.5 EA1.A 31.29,6.3 31.9,5.69 31.9,4.47 31.5,4.06 28.04,4.06 26.62,5.49 26.62,5.89 26.01,6.5 26.01,6.91 EC1.A 25.81,7.11 24.38,8.53 | 28.25,8.94 29.06,9.75 29.87,9.75 30.89,8.74 EA2.C | 28.25,8.94 EB2.C | 21.74,9.35 22.76,10.36 ED2.C | 21.74,9.35 21.13,8.74 EE1.A 20.93,8.74 19.91,9.75 18.9,9.75 EF1.A 18.9,9.96 18.9,10.57 19.71,11.38 | 24.38,8.53 25.2,9.35 EC2.C | 24.38,8.53 23.57,7.72 ED1.A 23.37,7.72 21.74,9.35 | EG1.A 16.66,11.18 16.66,12.39 17.48,13.21 EF2.C 17.48,13.41 16.87,14.02 | 15.24,15.24 14.63,14.63 EH1.A | 15.24,15.24 13.41,17.07 13.41,17.48 EH2.C | 15.24,15.24 EG2.C 15.44,15.44 16.87,14.02 | 19.71,11.38 19.91,11.58 EE2.C | 20.52,14.02 22.35,14.02 23.16,14.83 27.23,14.83 28.04,14.02 R5.2 | 20.52,14.02 19.71,13.21 19.71,11.38 | 16.87,14.02 17.88,15.04 17.88,15.24 18.9,16.26 19.71,16.26 20.52,15.44 20.52,14.02
XF  (via drill 0.51)
  Top 0.203: 28.45,18.09 28.25,17.88 R6.2 | 28.45,18.09 29.87,19.51 30.28,19.51 FH1.A | 31.9,17.07 31.9,17.68 FH2.C | 31.9,17.07 31.9,16.05 FG2.C 31.9,15.85 31.9,14.02 FF2.C 31.7,14.02 30.68,13.01 28.65,13.01 28.25,12.6 28.25,11.79 28.85,11.18 30.89,11.18 31.7,11.99 FE2.C | 28.45,18.09 29.46,17.07 31.9,17.07 | R6.2 28.45,18.09 | 8.13,27.03 9.14,28.04 FD2.C | 8.13,27.03 7.72,26.62 | 7.72,26.62 7.11,26.01 FF1.A | 7.72,26.62 8.94,25.4 9.35,25.4 FC2.C | 8.13,27.03 6.71,28.45 FG1.A 6.5,28.45 5.28,27.23 v5.28,26.82 | 12.39,15.24 12.6,15.04 12.6,14.63 FA1.A | 12.39,15.24 11.18,16.46 FB1.A 10.97,16.66 10.97,17.07 | 9.75,22.15 10.36,22.76 FB2.C | 9.75,22.15 9.35,21.74 | 9.35,21.74 8.74,21.13 FD1.A | 9.35,21.74 7.72,23.37 FE1.A | 9.75,19.91 9.75,22.15 | 9.75,19.91 9.75,18.9 FC1.A 9.96,18.69 9.96,18.29 10.97,17.27 10.97,17.07 | 9.75,19.91 11.58,19.91 FA2.C | v5.69,19.91 5.69,19.51 8.13,17.07 10.97,17.07 | v24.18,16.87 27.23,16.87 28.04,17.68 R6.2 | 12.39,15.24 v13.21,16.05
  Bottom 0.203: v5.28,26.82 5.28,26.21 5.69,25.81 v5.69,19.91 | v24.18,16.87 23.57,16.87 22.96,17.48 14.63,17.48 v13.21,16.05
XG  (via drill 0.51)
  Top 0.203: 8.74,37.59 9.35,36.98 GC2.C | 8.53,37.8 8.74,37.59 | 8.53,37.8 7.72,38.61 GD1.A | 8.74,37.59 8.74,39.83 | 8.74,39.83 8.74,41.05 GE1.A 8.74,41.25 8.74,42.27 9.75,43.28 GF1.A 9.96,43.28 10.57,43.28 | 8.74,39.83 10.36,39.83 GD2.C | GA2.C 6.5,31.09 GA1.A 6.3,31.29 4.06,33.53 3.45,33.53 3.05,33.93 3.05,34.75 3.45,35.15 7.11,35.15 | 7.11,33.73 8.74,33.73 8.94,33.93 GB2.C | 7.11,33.73 6.71,33.73 GB1.A | 7.11,35.15 7.11,33.73 | 7.11,35.15 7.11,36.17 GC1.A 7.11,36.37 8.53,37.8 | 10.57,43.28 11.58,42.27 GE2.C | 12.6,45.52 11.18,45.52 GG1.A 10.97,45.52 10.57,45.11 10.57,43.28 | 12.6,45.52 13.21,44.91 GF2.C 13.41,44.91 15.24,46.74 GG2.C 15.24,46.94 17.07,48.77 17.48,48.77 GH2.C 17.68,48.77 18.49,48.77 v19.91,47.35 | 12.6,45.52 12.6,47.55 GH1.A | v25.4,47.14 28.04,44.5 R7.2
  Bottom 0.203: v25.4,47.14 20.12,47.14 v19.91,47.35
XH  (via drill 0.51)
  Top 0.203: 21.13,53.24 20.93,53.44 HD1.A 21.13,53.24 | 21.13,53.24 21.74,52.63 | 21.74,52.63 22.55,51.82 HB2.C | 28.25,54.66 28.25,55.27 28.45,55.47 HG1.A | 28.25,54.66 28.25,53.44 HD2.C | 23.57,54.46 24.38,53.65 | 24.38,53.65 25.2,52.83 HC2.C | 24.38,53.65 v24.99,54.25 25.81,55.07 HF1.A | v27.64,54.66 28.25,54.66 | 21.74,52.63 23.57,54.46 | 23.57,54.46 HE1.A | 14.63,30.68 14.63,31.09 14.02,31.7 HF2.C | 14.63,30.68 14.63,29.87 14.22,29.46 13.41,29.46 13.01,29.87 13.01,30.68 11.99,31.7 HE2.C | 14.63,30.68 15.65,31.7 HG2.C | 16.87,31.9 15.85,31.9 HG2.C | 16.87,31.9 17.68,31.9 HH2.C | 16.87,31.9 16.87,29.87 17.27,29.46 18.09,29.46 18.9,30.28 19.51,30.28 HH1.A | 19.3,51.21 19.91,50.6 HA2.C 20.12,50.39 20.32,50.19 21.13,50.19 v21.74,49.58 | 19.3,51.21 18.9,51.61 18.9,52.43 HC1.A | v26.82,49.58 28.04,48.36 R8.2 | 19.1,51.21 19.3,51.21 | 19.1,51.21 16.66,51.21 HB1.A 16.46,51 15.04,49.58 14.63,49.58 HA1.A 14.63,49.38 v14.63,47.95 | v15.65,42.06 15.65,31.9 HG2.C | 19.1,51.21 21.13,53.24
  Bottom 0.203: v27.64,54.66 27.03,54.66 24.99,56.69 24.18,56.69 23.77,56.29 23.77,55.47 v24.99,54.25 | v21.74,49.58 v26.82,49.58 | v15.65,42.06 15.65,42.67 14.63,43.69 v14.63,47.95
XTAL1  (via drill 0.51)
  Top 0.203: v24.18,24.38 26.42,26.62 26.42,29.06 26.01,29.46 25.4,29.46 MCU.8
  Bottom 0.203: C2.1 16.26,23.98 16.66,23.98 17.27,23.37 21.34,23.37 22.15,24.18 MCU_OSC.1 22.35,24.38 v24.18,24.38
XTAL2  (via drill 0.51)
  Top 0.203: v22.76,30.28 25.2,30.28 MCU.7
  Bottom 0.203: C1.1 16.26,26.62 18.29,26.62 MCU_OSC.3 18.49,26.62 22.15,30.28 v22.76,30.28
YA  (via drill 0.51)
  Top 0.203: v11.18,15.24 11.58,14.83 11.58,13.82 FA1.C 11.79,13.61 11.79,12.39 v15.24,8.94 | v11.58,18.49 13.01,19.91 13.01,20.52 FA2.A 13.21,20.73 15.44,22.96 26.21,22.96 27.84,24.59 27.84,25.2 MCU.13 | 32.11,10.36 32.31,10.36 33.73,11.79 36.58,11.79 37.8,13.01 40.44,13.01 | 32.11,10.36 31.09,10.36 EA2.A | 40.44,13.01 41.45,13.01 DA2.A | v29.67,5.69 30.28,5.08 31.09,5.08 EA1.C | v32.11,10.16 32.11,10.36 | v47.14,11.58 48.56,11.58 DA1.C | 40.44,13.01 v40.44,12.6 | 51,31.09 51.82,31.09 CA2.A 52.02,31.29 52.63,31.9 56.49,31.9 57.1,31.29 CA1.C | 51,31.09 49.58,31.09 49.17,31.5 49.17,41.45 BA2.A 49.17,41.66 49.17,42.27 49.78,42.88 49.78,44.91 48.36,46.33 48.36,47.75 | 48.36,47.75 49.17,48.56 50.39,48.56 BA1.C | AA1.C 31.09,57.1 30.28,56.29 30.28,52.83 31.09,52.02 AA2.A 31.29,51.82 32.11,51 32.31,51 32.92,50.39 v32.92,49.38 | GA1.C 5.08,31.09 5.89,30.28 9.35,30.28 GA2.A 10.36,31.09 10.36,32.11 12.8,34.54 v12.8,40.23 | v17.48,50.19 18.49,49.17 20.52,49.17 HA2.A 20.73,48.97 20.93,48.77 v22.76,48.77 | v15.04,50.8 14.02,50.8 13.82,50.6 HA1.C | 48.36,47.75 v47.75,47.75 | v47.14,26.01 51,29.87 51,31.09
  Bottom 0.203: v11.18,15.24 11.18,18.09 v11.58,18.49 | v32.11,10.16 29.67,7.72 v29.67,5.69 21.54,5.69 18.29,8.94 v15.24,8.94 | v40.44,12.6 41.05,13.21 43.69,13.21 45.31,11.58 v47.14,11.58 v47.14,26.01 | v17.48,50.19 15.65,50.19 v15.04,50.8 14.43,50.8 12.8,49.17 v12.8,40.23 | v22.76,48.77 27.23,48.77 27.84,49.38 v32.92,49.38 33.33,49.78 45.11,49.78 47.14,47.75 v47.75,47.75
YB  (via drill 0.51)
  Top 0.203: v9.35,23.37 9.55,23.57 10.77,23.57 11.18,23.16 11.79,23.16 FB2.A | 9.75,32.92 9.75,33.12 10.36,33.73 GB2.A | 9.75,32.92 6.1,32.92 5.28,33.73 GB1.C 5.08,33.93 4.27,33.93 v3.86,34.34 | v9.75,32.72 9.75,32.92 | EB1.C 28.25,5.28 27.23,6.3 v27.23,6.5 27.23,9.35 28.25,10.36 EB2.A | v8.94,15.04 9.55,15.65 9.96,15.65 FB1.C | 23.37,17.27 21.95,15.85 v21.95,14.83 | 23.37,17.27 28.65,22.55 28.65,25.2 MCU.14 | v15.24,20.12 15.24,18.9 15.65,18.49 15.65,17.68 16.05,17.27 23.37,17.27 | AB1.C 33.93,57.1 34.95,56.08 34.95,52.83 33.93,51.82 AB2.A 33.73,51.61 v33.73,50.6 36.17,50.6 38.2,48.56 40.23,48.56 v44.5,44.3 | v20.93,51 21.54,50.39 22.96,50.39 HB2.A | v17.48,52.43 15.85,52.43 HB1.C 15.65,52.22 v14.02,52.22 | v42.27,10.36 42.06,10.16 40.84,10.16 40.23,9.55 39.22,9.55 38.61,10.16 38.61,10.77 39.01,11.18 39.01,11.79 DB2.A | v47.75,9.55 46.94,9.55 46.53,9.96 DB1.C | v47.95,24.59 51.61,28.25 CB2.A | v57.1,26.82 57.1,28.25 CB1.C | v50.39,34.95 50.39,39.01 BB2.A 50.39,39.22 v50.39,40.84 | v52.22,44.7 52.22,46.33 BB1.C
  Bottom 0.203: v9.75,32.72 10.36,32.11 10.36,25.81 9.35,24.79 v9.35,23.37 11.99,23.37 v15.24,20.12 | v8.94,15.04 8.94,13.01 11.18,10.77 21.34,10.77 21.74,10.36 21.74,7.92 21.34,7.52 21.34,6.71 21.74,6.3 22.96,6.3 | 22.96,6.3 27.03,6.3 v27.23,6.5 | v21.95,14.83 21.95,12.6 22.96,11.58 22.96,6.3 | v17.48,52.43 18.9,51 v20.93,51 21.34,50.6 v33.73,50.6 | v42.27,10.36 46.94,10.36 47.14,10.16 | 47.14,10.16 v47.75,9.55 49.17,9.55 49.58,9.96 49.58,10.36 57.3,18.09 57.3,22.35 57.1,22.55 v57.1,26.82 57.1,27.84 50.39,34.54 v50.39,34.95 | v47.95,24.59 47.95,10.97 47.14,10.16 | 52.22,44.3 52.22,43.08 50.39,41.25 v50.39,40.84 | v44.5,44.3 52.22,44.3 | 52.22,44.3 v52.22,44.7 | v3.86,34.34 3.86,35.36 4.67,36.17 4.67,43.48 13.41,52.22 v14.02,52.22
YC  (via drill 0.51)
  Top 0.203: v55.68,24.79 56.49,25.6 CC1.C | v53.65,26.21 51.82,26.21 51.41,25.81 CC2.A | v51.41,32.31 51,32.72 51,34.34 51.21,34.54 51.21,36.37 BC2.A 51.41,36.58 51.41,36.98 v52.43,38 | v53.24,42.27 53.65,42.67 53.65,44.09 BC1.C 53.65,44.3 53.65,46.74 v46.94,53.44 | v29.67,26.82 29.67,25.4 MCU.15 | v41.45,34.95 43.48,34.95 v46.74,38.2 | 24.99,6.71 v24.59,7.11 | 24.99,6.71 25.6,6.1 25.6,5.69 EC1.C | v24.59,11.18 25.6,11.18 EC2.A | 37.39,10.77 39.01,9.14 40.44,9.14 40.84,9.55 42.47,9.55 43.48,8.53 44.09,8.53 DC1.C | 37.39,10.77 37.19,10.97 36.58,10.97 DC2.A | v34.95,10.77 37.39,10.77 | v8.33,19.51 8.33,18.09 FC1.C | v9.14,26.42 10.36,26.42 10.97,25.81 FC2.A | v6.71,37.59 5.69,36.58 GC1.C 5.49,36.58 v3.86,36.58 | v9.75,35.15 10.97,36.37 GC2.A | 17.27,54.46 17.88,53.85 HC1.C 18.09,53.85 v19.71,53.85 | 17.27,54.46 17.27,55.47 20.12,58.32 34.75,58.32 35.36,57.71 | 35.36,57.71 36.37,56.69 AC1.C | v23.98,51.41 25.6,51.41 HC2.A | 35.36,57.71 35.36,52.83 36.37,51.82 36.37,51.41 AC2.A | v15.04,54.46 17.27,54.46 | v23.16,4.88 24.99,6.71 | v16.66,4.88 3.66,17.88 v3.66,18.29
  Bottom 0.203: v55.68,24.79 55.07,24.79 v53.65,26.21 53.65,28.25 51.41,30.48 v51.41,32.31 | v53.24,42.27 53.24,38.81 52.63,38.2 | v29.67,26.82 33.33,26.82 v41.45,34.95 | 52.63,38.2 v46.74,38.2 | 52.63,38.2 v52.43,38 | v24.59,7.11 24.59,10.97 | 24.59,10.97 34.75,10.97 v34.95,10.77 | 24.59,10.97 v24.59,11.18 | 7.52,20.32 6.5,21.34 6.5,23.16 9.14,25.81 v9.14,26.42 6.71,28.85 6.71,35.15 | 7.52,20.32 v8.33,19.51 | 6.71,35.15 v6.71,37.59 | 6.71,35.15 v9.75,35.15 | v23.98,51.41 22.15,51.41 19.91,53.65 | v3.86,36.58 3.86,43.28 v15.04,54.46 | v16.66,4.88 v23.16,4.88 | v3.66,18.29 5.49,18.29 7.52,20.32 | v46.94,53.44 43.28,57.1 23.37,57.1 19.91,53.65 | v19.71,53.85 19.91,53.65
YD  (via drill 0.51)
  Top 0.203: v35.97,8.33 33.93,10.36 DD2.A | v37.8,8.53 39.83,8.53 41.05,7.32 41.66,7.32 DD1.C 41.86,7.11 46.53,7.11 48.77,9.35 v48.77,10.36 | v31.7,22.35 30.48,23.57 30.48,25.2 MCU.16 | v22.15,7.11 22.96,6.3 ED1.C | v21.74,11.58 22.76,11.58 22.96,11.79 ED2.A 23.16,11.99 24.38,11.99 24.99,12.6 v24.99,13.61 | v7.32,21.74 7.32,20.52 FD1.C | v11.79,21.74 12.8,22.76 12.8,26.01 10.57,28.25 FD2.A | v53.24,23.57 51.41,23.57 51,23.16 50.39,23.16 CD2.A | v54.46,22.35 55.27,22.35 55.88,22.96 CD1.C 56.08,23.16 56.08,23.77 57.91,25.6 57.91,29.06 57.1,29.87 v56.9,29.87 | v54.05,36.17 51.82,33.93 BD2.A | v54.66,40.44 54.66,41.45 54.86,41.66 BD1.C 54.86,41.86 v54.86,43.48 | 38.2,51.82 37.8,52.22 37.8,54.86 39.01,56.08 AD1.C | 38.2,51.82 39.01,51 39.01,50.39 AD2.A | v7.92,40.23 6.91,39.22 6.3,39.22 GD1.C | v9.55,38.61 11.38,38.61 11.79,39.01 GD2.A | v18.09,55.07 20.32,55.07 HD1.C 20.52,54.86 21.13,54.86 21.54,54.46 v21.95,54.46 | v27.03,53.03 28.25,51.82 HD2.A | v38,51.61 38.2,51.82
  Bottom 0.203: v35.97,8.33 35.97,7.32 37.39,5.89 38.2,5.89 38.61,6.3 38.61,7.72 v37.8,8.53 37.8,11.79 31.9,17.68 | v31.7,22.35 31.7,17.88 31.9,17.68 | v22.15,7.11 22.15,11.18 v21.74,11.58 10.97,11.58 9.55,13.01 9.55,14.43 9.75,14.63 9.75,21.74 | 9.75,21.74 v11.79,21.74 | 9.75,21.74 v7.32,21.74 | 31.9,17.68 27.84,13.61 v24.99,13.61 | 54.25,22.55 v53.24,23.57 | 54.05,38.2 54.05,39.83 v54.66,40.44 | 54.05,38.2 v54.05,36.17 | v56.9,29.87 56.9,35.36 54.05,38.2 | v9.55,38.61 v7.92,40.23 7.11,41.05 7.11,43.28 9.14,45.31 9.14,46.33 10.97,48.16 11.18,48.16 v18.09,55.07 | v21.95,54.46 23.37,53.03 v27.03,53.03 28.45,51.61 v38,51.61 39.42,50.19 49.58,50.19 54.86,44.91 v54.86,43.48 | v48.77,10.36 48.77,11.38 56.9,19.51 56.9,22.15 56.49,22.55 54.25,22.55 | 54.25,22.55 v54.46,22.35
YE  (via drill 0.51)
  Top 0.203: v24.59,55.88 23.16,55.88 HE1.C | v29.46,52.43 30.28,51.61 30.28,51.41 30.68,51 30.89,51 31.7,50.19 BE2.A | 42.06,54.66 42.06,53.24 41.66,52.83 v41.66,52.43 41.66,50.8 41.25,50.39 41.45,50.19 41.45,49.17 AE2.A | 42.06,54.66 41.86,54.86 AE1.C 42.06,54.66 | v52.02,20.93 50.19,20.93 49.99,20.73 49.17,20.73 CE2.A 48.97,20.52 47.75,20.52 v44.5,17.27 | v53.44,19.91 54.46,19.91 54.86,20.32 CE1.C 55.07,20.52 56.08,20.52 58.93,23.37 58.93,36.17 56.08,39.01 BE1.C 55.88,39.22 55.88,48.97 50.19,54.66 42.06,54.66 | v50.19,33.12 50.19,31.9 DE2.A | v32.31,39.83 30.48,38 30.48,36.98 MCU.40 | HE2.A 11.79,30.48 11.18,31.09 11.18,32.31 13.61,34.75 13.61,41.05 13.21,41.45 GE2.A 13.01,41.45 12.19,41.45 11.99,41.25 v10.16,41.25 | v19.71,8.74 20.32,8.13 20.32,7.32 EE1.C | v20.93,9.96 20.93,12.8 | 20.93,12.8 20.73,13.01 EE2.A 20.93,12.8 | v29.06,12.19 30.28,12.19 FE2.A 30.48,12.19 31.09,12.8 32.51,12.8 32.72,12.6 v34.95,12.6 35.97,12.6 36.78,13.41 38.81,13.41 v39.83,14.43 | 20.93,12.8 v23.98,12.8 | v37.8,6.71 38.2,6.3 39.01,6.3 DE1.C | v4.27,24.99 6.1,23.16 FE1.C | v3.05,26.21 2.64,26.62 2.64,37.19 7.11,41.66 GE1.C 7.11,41.86 v7.92,42.67
  Bottom 0.203: v24.59,55.88 25.2,55.88 27.23,53.85 28.04,53.85 v29.46,52.43 v41.66,52.43 | v53.44,19.91 52.43,20.93 v52.02,20.93 51.41,21.54 51.41,29.87 50.19,31.09 | 50.19,31.09 v50.19,33.12 | v32.31,39.83 41.45,39.83 50.19,31.09 | 20.73,9.75 v19.71,8.74 | v29.06,12.19 28.04,12.19 27.43,12.8 v23.98,12.8 | v37.8,6.71 37.8,7.32 36.78,8.33 36.78,10.77 v34.95,12.6 | 20.73,9.75 10.97,9.75 2.85,17.88 2.85,22.35 4.27,23.77 v4.27,24.99 v3.05,26.21 | 20.73,9.75 v20.93,9.96 | v10.16,41.25 9.35,41.25 v7.92,42.67 | v44.5,17.27 42.67,17.27 v39.83,14.43
YF  (via drill 0.51)
  Top 0.203: 3.45,25.4 3.86,25.81 5.49,25.81 FF1.C | 3.45,25.4 2.64,25.4 2.23,25.81 2.23,37.39 6.3,41.45 6.3,42.27 8.33,44.3 GF1.C 8.53,44.3 9.35,44.3 v9.75,44.7 | EF1.C 17.88,8.53 17.88,12.6 18.49,13.21 18.49,14.43 EF2.A 18.49,14.63 v19.3,15.44 | v22.96,15.65 28.04,15.65 29.67,14.02 30.28,14.02 FF2.A | 18.29,8.13 18.09,8.33 EF1.C | 18.29,8.13 22.76,3.66 33.73,3.66 35.56,5.49 36.37,5.49 DF1.C | 3.45,25.4 3.45,19.71 5.89,17.27 5.89,16.26 14.02,8.13 18.29,8.13 | 18.29,8.13 EF1.C | 13.82,43.08 13.82,42.06 14.02,41.86 14.02,34.54 13.01,33.53 13.01,31.29 13.82,30.48 HF2.A | 13.82,43.08 14.43,43.69 GF2.A 14.63,43.69 v16.66,43.69 | v51.21,18.49 47.75,18.49 CF2.A | v52.83,16.87 53.85,17.88 CF1.C | v33.12,46.94 31.9,48.16 BF2.A | v33.12,41.86 29.67,38.41 29.67,36.98 MCU.41 | v23.16,41.45 23.16,47.14 26.62,50.6 26.62,51.61 26.21,52.02 26.21,53.44 26.82,54.05 26.82,55.68 26.42,56.08 26.21,56.08 25.81,56.49 HF1.C | v48.16,35.56 48.16,31.9 DF2.A | 56.69,35.97 56.69,36.37 BF1.C | v55.88,35.15 56.69,35.97 | v42.88,48.56 43.48,47.95 | 43.48,47.95 43.69,47.75 AF2.A | v44.7,52.43 44.3,52.83 44.3,53.65 AF1.C | 43.48,47.95 v43.48,51.21 | v56.08,21.74 58.52,24.18 58.52,34.14 56.69,35.97 | v11.38,44.3 12.6,44.3 13.82,43.08
  Bottom 0.203: v22.96,15.65 19.51,15.65 v19.3,15.44 | v51.21,18.49 v52.83,16.87 53.65,16.87 56.08,19.3 v56.08,21.74 | 32.72,41.45 v33.12,41.86 v33.12,46.94 34.75,48.56 v42.88,48.56 | 32.72,41.45 31.09,39.83 28.25,39.83 26.62,41.45 v23.16,41.45 22.35,41.45 20.12,43.69 v16.66,43.69 | 46.74,36.98 44.5,39.22 42.67,39.22 40.44,41.45 32.72,41.45 | 46.74,36.98 v48.16,35.56 | v55.88,35.15 52.43,35.15 50.6,36.98 46.74,36.98 | v43.48,51.21 v44.7,52.43 | v9.75,44.7 10.97,44.7 v11.38,44.3
YG  (via drill 0.51)
  Top 0.203: v15.65,14.02 15.65,10.16 EG1.C | v16.87,15.24 16.87,15.85 16.46,16.26 EG2.A | v28.85,16.05 30.28,16.05 FG2.A | 5.89,29.06 6.3,29.46 12.8,29.46 13.21,29.06 14.43,29.06 15.65,30.28 HG2.A | 5.89,29.06 5.28,28.45 FG1.C 5.08,28.25 v4.06,27.23 | v9.96,50.6 9.96,46.53 GG1.C | v20.73,57.51 28.04,57.51 28.25,57.3 HG1.C 28.45,57.1 29.46,56.08 v29.46,54.66 | 5.89,29.06 v5.08,29.87 | v10.36,13.41 9.35,13.41 6.3,16.46 6.3,18.09 4.88,19.51 v4.88,23.16 | v17.68,44.5 16.46,45.72 GG2.A | v28.65,40.64 28.65,36.98 MCU.42 | v29.26,45.52 30.89,45.52 31.7,46.33 BG2.A | v34.95,6.3 33.93,5.28 DG1.C | v37.8,3.45 43.89,3.45 45.92,5.49 47.75,5.49 52.43,10.16 v53.03,10.16 | v53.03,12.6 53.03,15.04 52.43,15.65 CG1.C | v44.7,15.24 45.72,16.26 CG2.A | v45.31,32.92 46.33,31.9 DG2.A | v57.71,32.31 57.3,32.72 57.3,33.73 BG1.C | v43.08,36.37 45.72,39.01 45.72,45.72 AG2.A 45.72,45.92 44.5,45.92 | v45.72,53.24 45.72,53.03 46.33,52.43 AG1.C | v40.64,51 40.64,48.77 43.48,45.92 44.5,45.92 | 44.5,45.92 v44.5,45.72
  Bottom 0.203: v28.85,16.05 23.77,16.05 22.96,16.87 18.49,16.87 v16.87,15.24 v15.65,14.02 15.04,14.02 14.02,13.01 10.77,13.01 v10.36,13.41 | v20.73,57.51 16.87,57.51 v9.96,50.6 3.05,43.69 3.05,33.93 5.08,31.9 v5.08,29.87 | v4.88,23.16 4.88,24.38 5.08,24.59 5.08,25.81 4.06,26.82 v4.06,27.23 | v17.68,44.5 19.91,44.5 22.15,42.27 26.01,42.27 | 26.01,42.27 27.03,42.27 v28.65,40.64 | 26.01,42.27 v29.26,45.52 30.48,45.52 34.34,49.38 44.91,49.38 46.13,48.16 46.13,47.35 v44.5,45.72 | v37.8,3.45 v34.95,6.3 | v44.7,15.24 41.86,15.24 39.62,13.01 39.62,12.19 | 39.62,12.19 39.62,10.77 42.47,7.92 52.63,7.92 53.24,8.53 53.24,9.96 v53.03,10.16 v53.03,12.6 57.91,17.48 57.91,27.23 57.71,27.43 v57.71,32.31 | 39.62,12.19 37.8,14.02 37.8,14.83 45.31,22.35 v45.31,32.92 45.31,33.53 43.08,35.76 v43.08,36.37 | 44.7,53.24 43.69,53.24 41.45,51 v40.64,51 | 44.7,53.24 v45.72,53.24 | v29.46,54.66 43.28,54.66 44.7,53.24
YH  (via drill 0.51)
  Top 0.203: FH2.A 30.48,17.88 30.48,18.29 31.7,19.51 FH1.C 31.9,19.71 31.9,21.34 32.51,21.95 32.51,22.96 v31.9,23.57 | 42.27,30.68 41.66,31.29 41.66,32.31 42.06,32.72 43.48,32.72 | 42.27,30.68 42.47,30.48 DH1.C 42.27,30.68 | 43.48,32.72 44.3,31.9 DH2.A | 42.27,28.65 43.69,27.23 43.69,14.63 CH2.A 43.69,14.43 43.69,13.21 44.5,12.39 45.11,12.39 46.53,13.82 47.75,13.82 47.95,13.61 50.39,13.61 CH1.C | 42.27,28.65 42.27,30.68 | 43.48,32.72 47.55,36.78 47.55,43.69 AH2.A 47.55,43.89 v47.55,45.11 | v49.17,49.38 48.77,49.78 48.77,50.39 AH1.C | v40.23,28.65 42.27,28.65 | BH2.A 31.7,44.3 30.48,43.08 30.48,42.67 BH1.C 30.28,42.47 29.26,42.47 27.84,41.05 27.84,36.98 MCU.43 27.84,36.78 27.84,35.36 | v13.61,13.82 13.61,11.79 EH1.C | v15.04,16.66 15.04,17.88 14.63,18.29 EH2.A | 18.49,30.68 19.51,31.7 HH1.C 19.71,31.7 v20.73,30.68 | 18.49,30.68 18.29,30.48 17.68,30.48 HH2.A | 18.49,30.68 18.49,47.55 GH2.A 18.29,47.55 v17.07,47.55 | v13.61,48.77 11.79,48.77 GH1.C | v26.82,34.34 27.84,35.36 | v35.15,26.82 32.51,29.46 32.31,29.46 30.68,31.09 30.68,32.51 27.84,35.36
  Bottom 0.203: v49.17,49.38 49.17,46.74 v47.55,45.11 | v31.9,23.57 v35.15,26.82 36.98,28.65 v40.23,28.65 | v13.61,13.82 13.61,15.24 | 13.61,15.24 v15.04,16.66 | v13.61,48.77 15.85,48.77 v17.07,47.55 | 13.61,15.24 12.8,15.24 12.39,15.65 12.39,21.13 12.6,21.34 12.6,22.15 12.19,22.55 8.94,22.55 8.53,22.96 8.53,24.59 9.96,26.01 9.96,31.29 8.94,32.31 8.94,33.12 9.35,33.53 10.97,33.53 16.66,27.84 18.69,27.84 20.73,29.87 v20.73,30.68 20.73,31.9 23.16,34.34 v26.82,34.34

### Text on the board
tPlace: 12 | 9 | 3 | 6
bPlace: LED Analog Clock v2 | (c) 2010 Jeremy Cole | 2010-04-24 | jeremy@jcole.us | VCC | TXD | RXD | GND | VCC | SDA | SCL | GND | GND | VCC | RST | SCK | MISO | MOSI